# EAGLE design lpi (EAGLE 5.10)
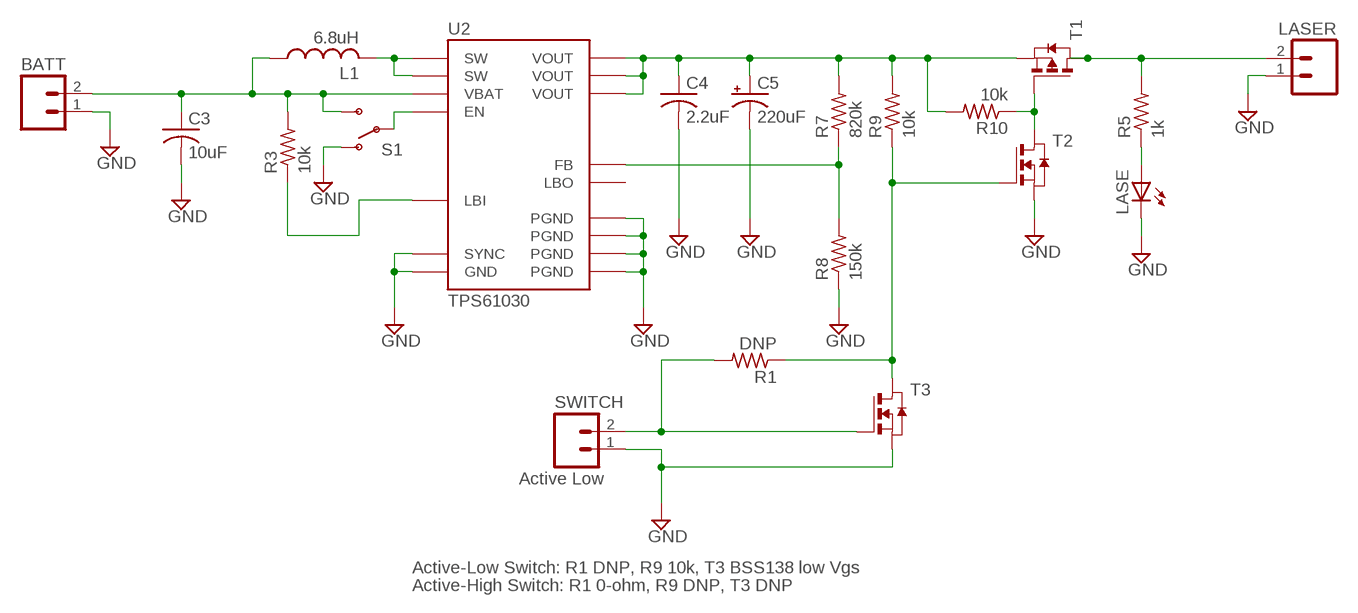
[diagram p0: schematic, sheet 1]

## Parts
BATT  M02  [1X02_LONGPADS]
C3  10uF  C-USC0805  [C0805]
C4  2.2uF  C-USC0805  [C0805]
C5  220uF  CPOL-USD/7343-31W  [D/7343-31W]
L1  6.8uH  POWER_CHOKE  [POWER_CHOKE]
LASE  LED0603  [LED-0603]
LASER  M02  [1X02_LONGPADS]
R1  DNP  R-US_R0603  [R0603]
R3  10k  R-US_R0603  [R0603]
R5  1k  R-US_R0603  [R0603]
R7  820k  R-US_R0603  [R0603]
R8  150k  R-US_R0603  [R0603]
R9  10k  R-US_R0603  [R0603]
R10  10k  R-US_R0603  [R0603]
S1  SWITCH-SPSTSMD2  [SWITCH-SPDT-SMD]
SWITCH  M02  [1X02_LONGPADS]
T1  PMOSSOT223  [SOT223]
T2  NMOSSOT23  [SOT-23]
T3  NMOSSOT23  [SOT-23]
U2  TPS61030  [HTSSOP16PWP]

## Nets
GND: BATT.1 C3.2 C4.2 C5.- LASE.C LASER.1 R8.1 S1.1(O) SWITCH.1 T2.2(S) T3.2(S) U2.3(PGND) U2.4(PGND) U2.5(PGND) U2.8(SYNC) U2.11(GND) U2.EXP(PGND)
N$1: BATT.2 C3.1 L1.A R3.2 S1.3(S) U2.6(VBAT)
N$2: R1.2 SWITCH.2 T3.3(G)
N$5: R3.1 U2.7(LBI)
N$6: L1.B U2.1(SW) U2.2(SW)
N$7: R1.1 R9.1 T2.3(G) T3.1(D)
N$8: R10.1 T1.1(G) T2.1(D)
N$10: S1.2(P) U2.9(EN)
N$11: C4.1 C5.+ R7.2 R9.2 R10.2 T1.3(S) U2.13(VOUT) U2.14(VOUT) U2.15(VOUT)
N$12: R7.1 R8.2 U2.12(FB)
N$13: LASER.2 R5.2 T1.2(D) T1.4(D2)
N$14: LASE.A R5.1
Unconnected: U2.10(LBO)

## Notes on the sheet
- Active Low
- Active-Low Switch: R1 DNP, R9 10k, T3 BSS138 low Vgs
- Active-High Switch: R1 0-ohm, R9 DNP, T3 DNP

## Library data of the parts
BATT LASER SWITCH = hizook:M02: Header 2 Standard 2-pin 0.1" header. Use with straight break away headers (SKU : PRT-00116), right angle break away headers (PRT-00553), swiss pins (PRT-00743), machine pins (PRT-00117), and female headers (PRT-00115). Molex polarized connector foot print use with SKU : PRT-08233 with associated crimp pins and housings.
C3 C4 = rcl:C-US: CAPACITOR, American symbol
C5 = rcl:CPOL-US: POLARIZED CAPACITOR, American symbol
L1 = hizook:POWER_CHOKE: Digikey #732-2189-1-nd
LASE = hizook:LED: LEDs Standard schematic elements and footprints for 5mm, 3mm, 1206, and 0603 sized LEDs. 5mm - Spark Fun Electronics SKU : COM-00529 (and others)
R1 R3 R5 R7-R10 = rcl:R-US_: RESISTOR, American symbol
S1 = hizook:SWITCH-SPST: SPST Switch Simple slide switch. Spark Fun Electronics SKU : COM-00102
T1 = hizook:PMOSSOT223: MOS FET (DigiKey #NDT456PCT-ND)
T2 T3 = zetex:NMOSSOT23: MOS FET
U2 = hizook:TPS61030: Boost Converter. Adjustable out (3.3-5.0V) 1A. DigiKey Part #296-14416-1-nd

## Board
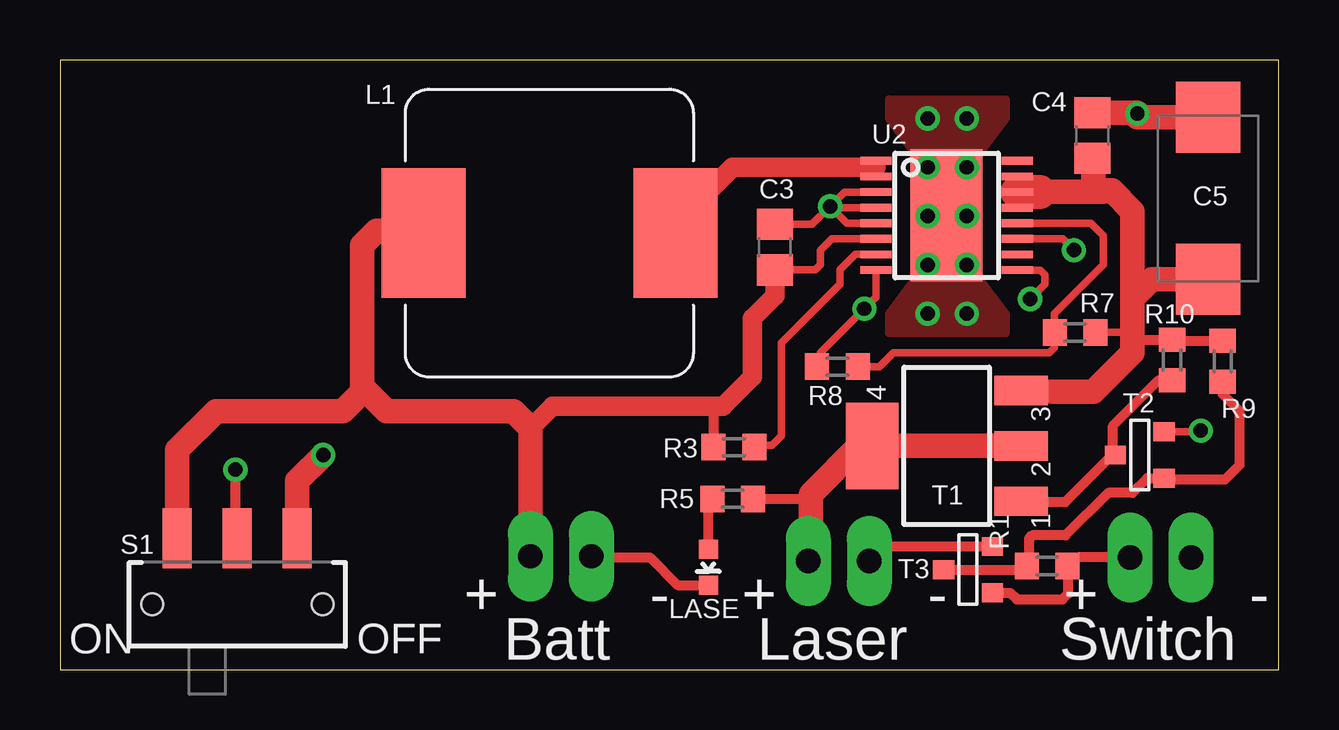
[diagram p1: board, top side]
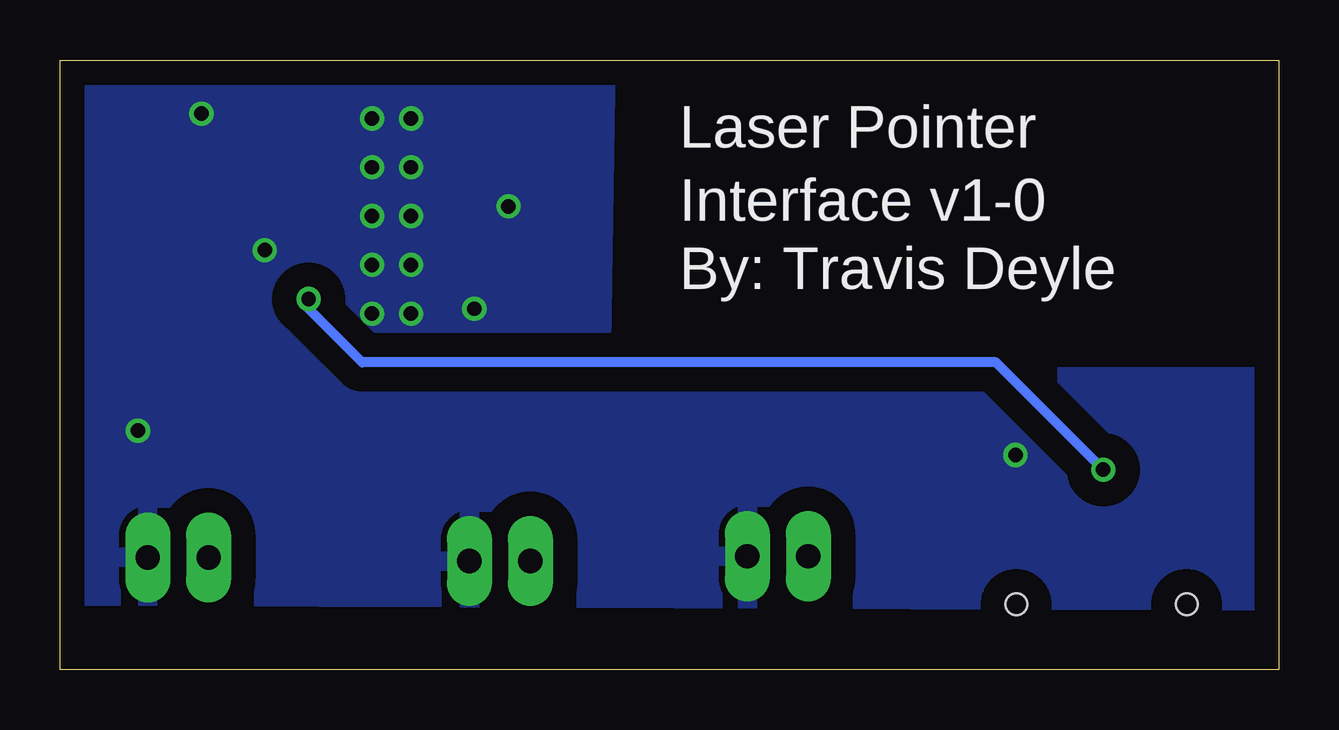
[diagram p2: board, bottom side, seen from below]

Size 50.8 x 25.4 mm. Coordinates in mm from the lower left corner, seen from the top.
Outline: 0,0 50.8,0 50.8,25.4 0,25.4 0,0
Copper layers (1*16): Top 0.035mm / dielectric 1.5mm / Bottom 0.035mm
Design rules "default *": minimum track width 10mil, minimum drill 20mil, track to track 8mil, track to pad 8mil, pad to pad 8mil, via to via 8mil, smd to smd 8mil, copper to edge 25mil, drill to drill 8mil, minimum pad ring 10mil, minimum via ring 8mil, stop-mask expansion 4mil, vias tented up to drill 0mil, thermal gap 10mil
tRestrict: area 14.4,12.2 to 26.6,24.2; area 45.9,17.3 to 49.8,21.9

### Footprints (pad centres in the part's own frame; a part is rotated, then mirrored left to right if it is on the bottom)
1X02_LONGPADS = drill 1.016 pad 1.88 long: 1 0,0; 2 2.54,0
C0805 = smd 1.3 x 1.5: 1 -0.95,0; 2 0.95,0
D/7343-31W = smd 2.95 x 2.7: + 3.375,0; - -3.375,0
POWER_CHOKE = smd 5.4 x 3.5: A 0,5.25; B 0,-5.25
LED-0603 = smd 0.8 x 0.8: A 0,-0.75; C 0,0.75
R0603 = smd 1 x 1.1: 1 -0.85,0; 2 0.85,0
SWITCH-SPDT-SMD = smd 1.2 x 2.5: 1 -2.5,-2.75; 2 0,-2.75; 3 2.5,-2.75 | hole 0.9: -3.55,0; 3.55,0
SOT223 = smd 1.219 x 2.235: 1 -2.311,-3.099; 2 0,-3.099; 3 2.311,-3.099 | smd 3.6 x 2.2: 4 0,3.099
SOT-23 = smd 0.787 x 0.889: 1 0.025,-1.016; 2 -0.94,1.016; 3 0.991,1.016
HTSSOP16PWP = smd 0.325 x 1.3: 1 -2.275,-2.95; 2 -1.625,-2.95; 3 -0.975,-2.95; 4 -0.325,-2.95; 5 0.325,-2.95; 6 0.975,-2.95; 7 1.625,-2.95; 8 2.275,-2.95; 9 2.275,2.95; 10 1.625,2.95; 11 0.975,2.95; 12 0.325,2.95; 13 -0.325,2.95; 14 -0.975,2.95; 15 -1.625,2.95; 16 -2.275,2.95 | smd 5.5 x 3: EXP 0,0

### Placement (x,y rotation side)
BATT  22.15,4.72 180 top
C3  29.79,17.6 90 top
C4  43.03,22.25 90 top
C5  47.85,19.63 270 top
L1  20.4,18.19 90 top
LASE  27.03,4.27 180 top
LASER  33.73,4.52 180 top
R1  41.15,4.32 0 top
R3  28.09,9.27 180 top
R5  28.04,7.11 0 top
R7  42.32,14.05 0 top
R8  32.41,12.62 0 top
R9  48.46,12.85 90 top
R10  46.35,12.9 90 top
S1  7.39,2.72 180 top
SWITCH  47.14,4.67 180 top
T1  36.96,9.32 90 top
T2  45.01,8.97 270 top
T3  37.85,4.19 270 top
U2  36.96,18.92 270 top

### Tracks (layer width: path | path; a pad name or v marks a point on that pad's centre or on a via)
GND  (via drill 0.6)
  Top 0.305: U2.3 32.7,19.9 v32.11,19.3 | U2.4 32.16,19.25 v32.11,19.3 | U2.5 32.81,18.6 v32.11,19.3 | U2.8 34.01,15.52 v33.53,15.04 31.7,13.21 31.7,12.76 R8.1 | C3.2 31.35,18.55 v32.11,19.3 | T2.2 47.5,9.91 v47.55,9.96 | U2.11 41.79,17.95 v42.27,17.48
  Top 0.406: 46.89,23.01 C5.- | 22.35,4.93 BATT.1 22.2,4.67 24.59,4.67 25.74,3.52 LASE.C | T3.2 34.34,5.13 LASER.1
  Top 1.016: S1.1 9.89,7.86 v10.97,8.94 | C4.2 44.91,23.2 v44.91,23.16 44.91,23.01 46.89,23.01
  other vias: 36.17,18.9 37.8,18.9 36.17,20.93 37.8,20.93 37.8,22.96 36.17,22.96 36.17,16.87 37.8,16.87 37.8,14.83 36.17,14.83
  pour Top (no thermals): 35.76,16.46 34.54,14.83 34.54,14.02 39.42,14.02 39.42,14.83 38.2,16.46 38.2,21.34 39.42,22.96 39.42,23.77 34.54,23.77 34.54,22.96 35.76,21.34
  pour Bottom (isolate 1.016): 28.04,25.4 49.78,25.4 49.78,3.05 0.61,2.84 0.81,12.19 28.24,12.19
N$1
  Top 0.305: U2.6 32.17,17.95 31.7,17.48 31.7,16.87 31.5,16.66 29.8,16.66 C3.1
  Top 0.406: 19.61,8.94 19.62,8.95 | 19.61,7.72 19.83,7.94 | R3.2 27.24,10.96 27.23,10.97
  Top 0.813: 19.61,10.06 20.52,10.97 27.23,10.97 27.64,10.97 28.85,12.19 28.85,14.63 29.8,15.58 29.8,16.66
  Top 1.016: BATT.2 19.61,7.72 19.61,8.94 19.61,10.06 18.9,10.77 13.61,10.77 12.7,11.68 | 12.7,11.68 12.6,11.79 12.6,17.68 13.21,18.29 15.04,18.29 L1.A | S1.3 4.89,9.16 6.5,10.77 11.79,10.77 12.7,11.68
N$2
  Top 0.406: SWITCH.2 44.58,4.7 42.51,4.7 R1.2 42.04,4.15 42.04,3.17 41.78,2.92 39.88,2.92 39.6,3.2 T3.3
N$5
  Top 0.305: U2.7 33.15,17.3 32.51,16.66 32.51,16.05 30.07,13.61 30.07,9.75 29.67,9.35 29.02,9.35 R3.1
N$6
  Top 0.305: U2.2 34.01,20.93 U2.1
  Top 0.813: 26.52,18.19 L1.B 26.01,18.55 26.01,18.9 28.04,20.93 34.01,20.93
N$7
  Top 0.406: R9.1 48.46,11.48 49.17,10.77 49.17,8.53 48.56,7.92 46.08,7.92 T2.3 45.31,7.98 44.7,7.37 43.69,7.37 41.91,5.59 40.51,5.59 40.39,5.46 40.39,4.28 R1.1 40.3,4.17 T3.1
N$8
  Top 0.406: R10.1 45.78,12.05 43.89,10.16 43.89,9.04 | 43.89,9.04 T2.1 | 43.89,9.04 43.89,8.97 41.91,6.99 40.08,6.99 T1.1
N$10  (via drill 0.6)
  Top 0.305: U2.9 40.86,16.65 41.05,16.46 41.05,16.05 v40.44,15.44 | S1.2 7.32,5.54
  Top 0.406: 7.32,5.54 v7.32,8.33
  Bottom 0.406: v40.44,15.44 40.44,15.04 38.2,12.8 11.79,12.8 v7.32,8.33
N$11
  Top 0.305: U2.15 U2.14 U2.13 | R7.2 44.48,14.05 44.7,13.82
  Top 0.406: 44.7,13.61 44.84,13.75 R10.2 46.41,13.7 R9.2
  Top 1.016: 42.88,19.91 40.84,19.91 40.83,19.9 | 42.88,19.91 43.08,19.91 | 43.08,19.91 43.48,19.91 | 48.05,16.26 C5.+ 45.52,16.26 44.7,15.44 | 44.7,15.44 44.7,13.82 44.7,13.61 44.7,13.21 43.08,11.58 41.38,11.58 T1.3 | 44.7,15.44 44.7,19.1 43.84,19.96 42.88,19.96 42.88,19.91 | C4.1 43.08,21.3 43.08,19.91
  Top 1.422: 40.83,19.9 U2.14
N$12
  Top 0.305: R8.2 34.16,12.62 34.75,13.21 41.25,13.21 41.45,13.41 41.45,14.03 R7.1 41.45,14.06 41.45,14.83 43.48,16.87 43.48,18.09 42.97,18.6 U2.12
N$13
  Top 0.406: R5.2 31.09,7.11 31.29,7.32
  Top 1.016: T1.2 T1.4 33.3,9.32 31.29,7.32 31.29,4.62 LASER.2 31.09,4.62
N$14
  Top 0.406: LASE.A 27.03,6.95 R5.1

### Text on the board
tPlace: + | - | + | - | + | - | ON | OFF | Batt | Laser | Switch
bPlace: Laser Pointer | Interface v1-0 | By: Travis Deyle